# EAGLE design master_control_shield (EAGLE 5.11)
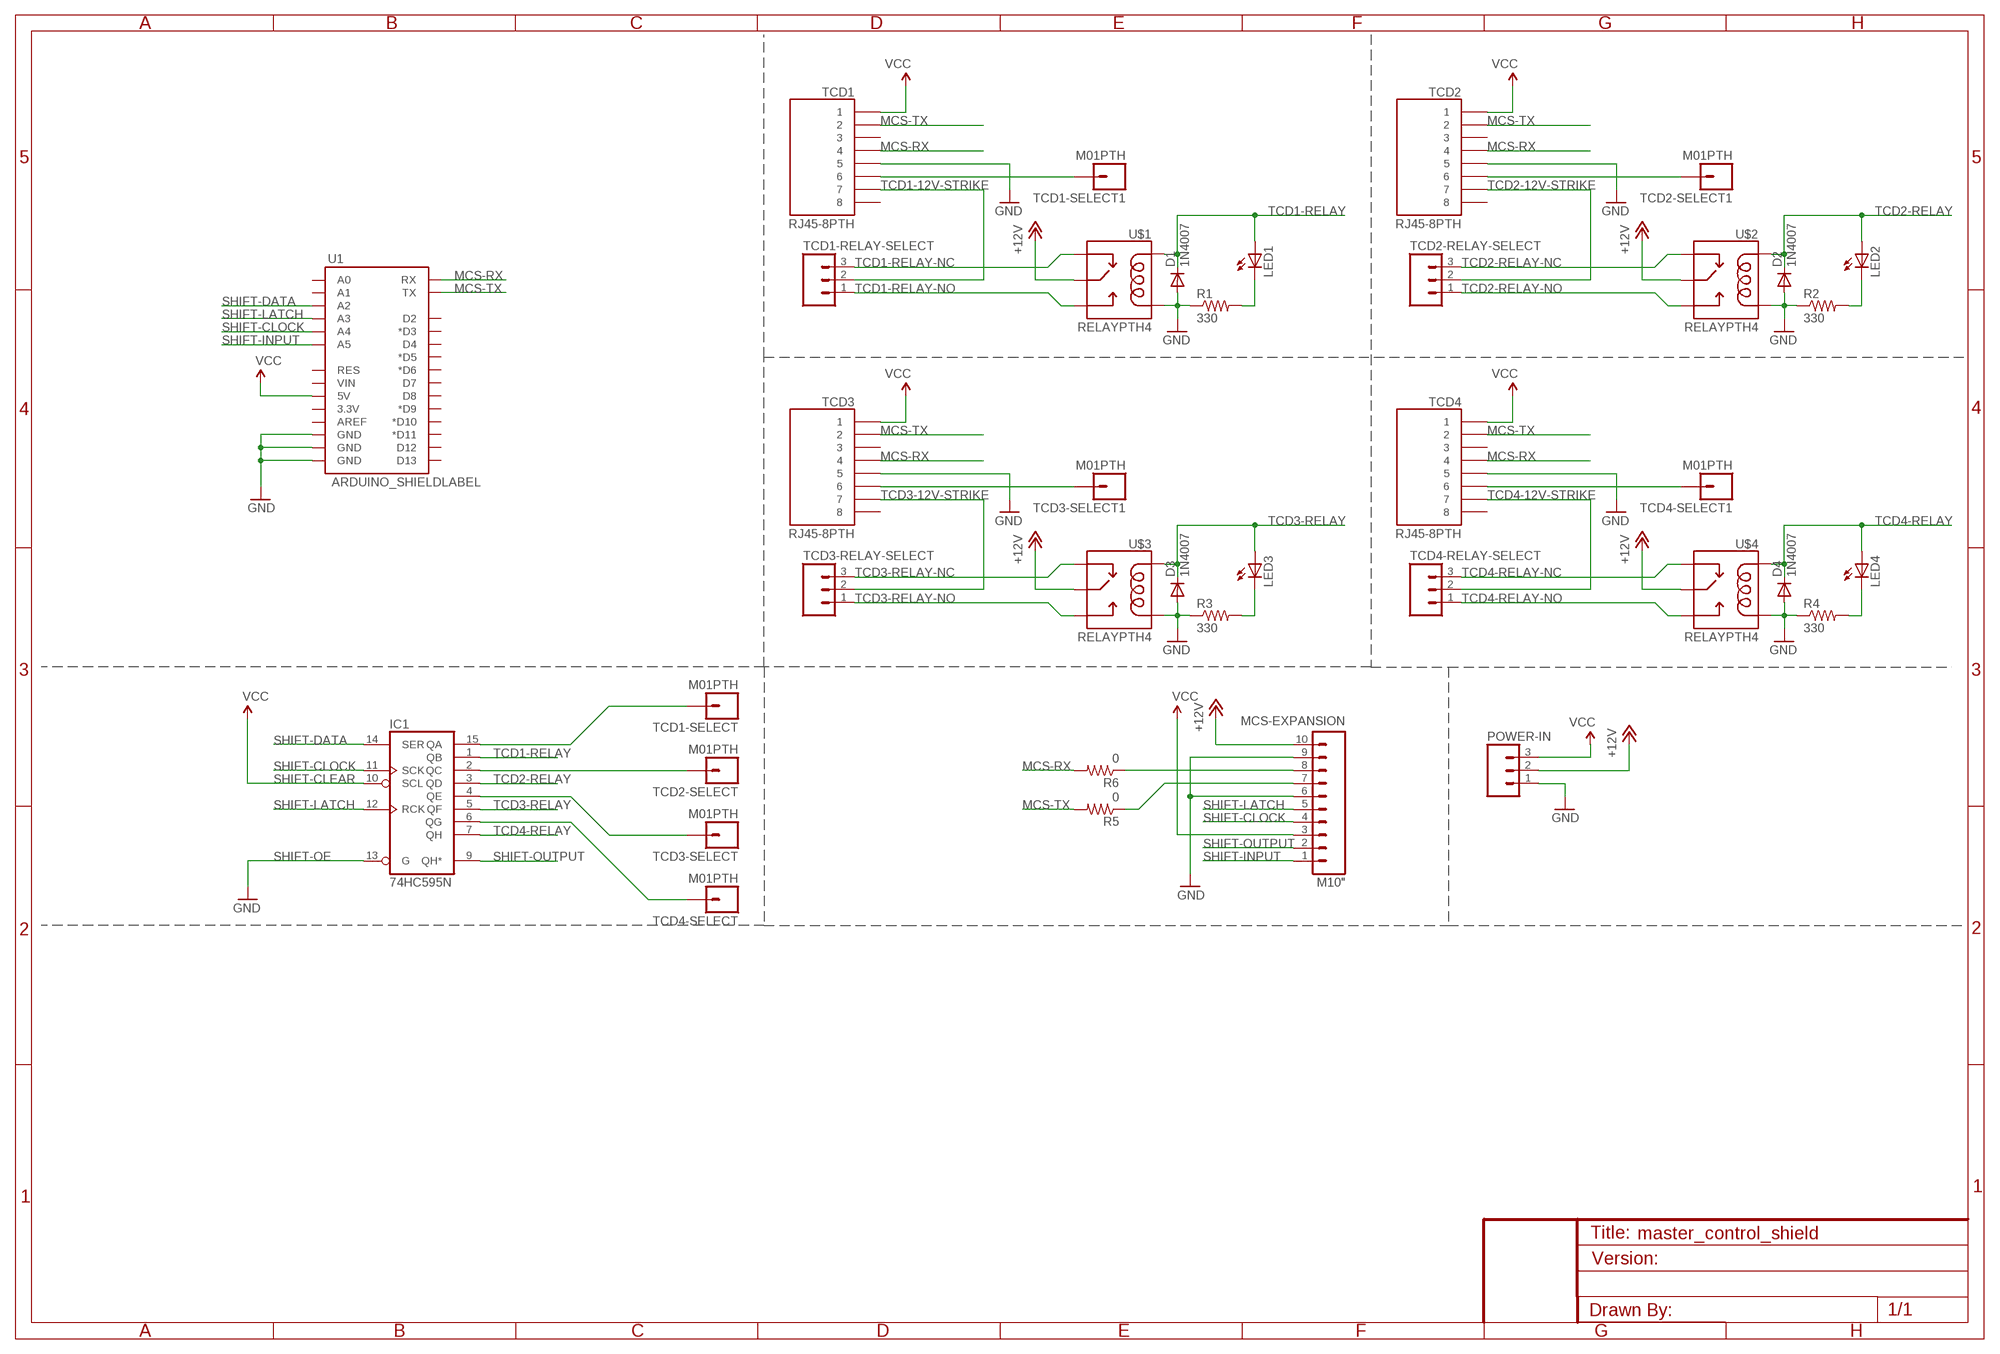
[diagram p0: schematic, sheet 1]

## Parts
D1  1N4007  DIODEPTH  [DIODE-1N4001]
D2  1N4007  DIODEPTH  [DIODE-1N4001]
D3  1N4007  DIODEPTH  [DIODE-1N4001]
D4  1N4007  DIODEPTH  [DIODE-1N4001]
IC1  74HC595N  74LS595N  [DIL16]
LED1  LED5MM  [LED5MM]
LED2  LED5MM  [LED5MM]
LED3  LED5MM  [LED5MM]
LED4  LED5MM  [LED5MM]
MCS-EXPANSION  M10"  [1X10]
POWER-IN  M03SCREW  [SCREWTERMINAL-3.5MM-3]
R1  330  RESISTORPTH-1/4W  [AXIAL-0.4]
R2  330  RESISTORPTH-1/4W  [AXIAL-0.4]
R3  330  RESISTORPTH-1/4W  [AXIAL-0.4]
R4  330  RESISTORPTH-1/4W  [AXIAL-0.4]
R5  0  RESISTORPTH-1/4W  [AXIAL-0.4]
R6  0  RESISTORPTH-1/4W  [AXIAL-0.4]
TCD1  RJ45-8PTH  [RJ45-8]
TCD1-RELAY-SELECT  M03PTH  [1X03]
TCD1-SELECT  M01PTH  [1X01]
TCD1-SELECT1  M01PTH  [1X01]
TCD2  RJ45-8PTH  [RJ45-8]
TCD2-RELAY-SELECT  M03PTH  [1X03]
TCD2-SELECT  M01PTH  [1X01]
TCD2-SELECT1  M01PTH  [1X01]
TCD3  RJ45-8PTH  [RJ45-8]
TCD3-RELAY-SELECT  M03PTH  [1X03]
TCD3-SELECT  M01PTH  [1X01]
TCD3-SELECT1  M01PTH  [1X01]
TCD4  RJ45-8PTH  [RJ45-8]
TCD4-RELAY-SELECT  M03PTH  [1X03]
TCD4-SELECT  M01PTH  [1X01]
TCD4-SELECT1  M01PTH  [1X01]
U1  ARDUINO_SHIELDLABEL  [DUEMILANOVE_SHIELD]
U$1  RELAYPTH4  [RELAY-JZC]
U$2  RELAYPTH4  [RELAY-JZC]
U$3  RELAYPTH4  [RELAY-JZC]
U$4  RELAYPTH4  [RELAY-JZC]

## Nets
+12V [signal]: MCS-EXPANSION.10 POWER-IN.2 U$1.4(MAIN) U$2.4(MAIN) U$3.4(MAIN) U$4.4(MAIN)
GND: D1.A D2.A D3.A D4.A IC1.13(G) MCS-EXPANSION.6 MCS-EXPANSION.9 POWER-IN.1 R1.P$1 R2.P$1 R3.P$1 R4.P$1 TCD1.5 TCD2.5 TCD3.5 TCD4.5 U1.GND@0(GND) U1.GND@1(GND) U1.GND@2(GND) U$1.1(COIL2) U$2.1(COIL2) U$3.1(COIL2) U$4.1(COIL2)
MCS-RX: R6.P$2 TCD1.4 TCD2.4 TCD3.4 TCD4.4 U1.RX
MCS-TX: R5.P$2 TCD1.2 TCD2.2 TCD3.2 TCD4.2 U1.TX
N$1: LED1.K(C) R1.P$2
N$2: LED2.K(C) R2.P$2
N$3: LED3.K(C) R3.P$2
N$4: LED4.K(C) R4.P$2
N$5: MCS-EXPANSION.8 R6.P$1
N$6: MCS-EXPANSION.7 R5.P$1
N$7: IC1.15(QA) TCD1-SELECT.1
N$8: IC1.2(QC) TCD2-SELECT.1
N$9: IC1.4(QE) TCD3-SELECT.1
N$10: IC1.6(QG) TCD4-SELECT.1
N$11: TCD1-SELECT1.1 TCD1.6
N$12: TCD2-SELECT1.1 TCD2.6
N$13: TCD3-SELECT1.1 TCD3.6
N$14: TCD4-SELECT1.1 TCD4.6
SHIFT-CLOCK: IC1.11(SCK) MCS-EXPANSION.4 U1.A4
SHIFT-DATA: IC1.14(SER) U1.A2
SHIFT-INPUT: MCS-EXPANSION.1 U1.A5
SHIFT-LATCH: IC1.12(RCK) MCS-EXPANSION.5 U1.A3
SHIFT-OUTPUT: IC1.9(QH*) MCS-EXPANSION.2
TCD1-12V-STRIKE: TCD1-RELAY-SELECT.2 TCD1.7
TCD1-RELAY: D1.C IC1.1(QB) LED1.A U$1.5(COIL1)
TCD1-RELAY-NC: TCD1-RELAY-SELECT.3 U$1.2(NC)
TCD1-RELAY-NO: TCD1-RELAY-SELECT.1 U$1.3(NO)
TCD2-12V-STRIKE: TCD2-RELAY-SELECT.2 TCD2.7
TCD2-RELAY: D2.C IC1.3(QD) LED2.A U$2.5(COIL1)
TCD2-RELAY-NC: TCD2-RELAY-SELECT.3 U$2.2(NC)
TCD2-RELAY-NO: TCD2-RELAY-SELECT.1 U$2.3(NO)
TCD3-12V-STRIKE: TCD3-RELAY-SELECT.2 TCD3.7
TCD3-RELAY: D3.C IC1.5(QF) LED3.A U$3.5(COIL1)
TCD3-RELAY-NC: TCD3-RELAY-SELECT.3 U$3.2(NC)
TCD3-RELAY-NO: TCD3-RELAY-SELECT.1 U$3.3(NO)
TCD4-12V-STRIKE: TCD4-RELAY-SELECT.2 TCD4.7
TCD4-RELAY: D4.C IC1.7(QH) LED4.A U$4.5(COIL1)
TCD4-RELAY-NC: TCD4-RELAY-SELECT.3 U$4.2(NC)
TCD4-RELAY-NO: TCD4-RELAY-SELECT.1 U$4.3(NO)
VCC: IC1.10(SCL) MCS-EXPANSION.3 POWER-IN.3 TCD1.1 TCD2.1 TCD3.1 TCD4.1 U1.5V
Unconnected: TCD1.3 TCD1.8 TCD2.3 TCD2.8 TCD3.3 TCD3.8 TCD4.3 TCD4.8 U1.3.3V U1.A0 U1.A1 U1.AREF U1.D2 U1.D3(*D3) U1.D4 U1.D5(*D5) U1.D6(*D6) U1.D7 U1.D8 U1.D9(*D9) U1.D10(*D10) U1.D11(*D11) U1.D12 U1.D13 U1.RES U1.VIN

## Notes on the sheet
- SHIFT-CLEAR
- SHIFT-OE

## Power pins joined to a net without a drawn wire
GND: IC1.8(GND)
VCC: IC1.16(VCC)

## Library data of the parts
D1-D4 = SparkFun:DIODE: Diode These are standard reverse protection diodes and small signal diodes. SMA package can handle up to about 1A. SOD-323 can handle about 200mA. What the SOD-323 package when ordering, there are some mfgs out there that are 5-pin packages.
IC1 = 74xx-us:74*595: 8-bit SHIFT REGISTER, output latch
LED1-LED4 = SparkFun:LED: LEDs Standard schematic elements and footprints for 5mm, 3mm, 1206, and 0603 sized LEDs. 5mm - Spark Fun Electronics SKU : COM-00529 (and others)
MCS-EXPANSION = SparkFun:M10: Header 10 Standard 10-pin 0.1" header. Use with straight break away headers (SKU : PRT-00116), right angle break away headers (PRT-00553), swiss pins (PRT-00743), machine pins (PRT-00117), and female headers (PRT-00115).
POWER-IN TCD1-RELAY-SELECT TCD2-RELAY-SELECT TCD3-RELAY-SELECT TCD4-RELAY-SELECT = SparkFun:M03: Header 3 Standard 3-pin 0.1" header. Use with straight break away headers (SKU : PRT-00116), right angle break away headers (PRT-00553), swiss pins (PRT-00743), machine pins (PRT-00117), and female headers (PRT-00115). Molex polarized connector foot print use with SKU : PRT-08232 with associated crimp pins and housings.
R1-R6 = SparkFun:RESISTOR: Resistor Basic schematic elements and footprints for 0603, 1206, and PTH resistors.
TCD1-TCD4 = SparkFun:RJ45-8: RJ45 Jack Simple RJ45, 8-pin connection - connector for common Cat5, Cat5e, and Cat6 Ethernet cables. Footprint not yet proven in production. Connector sku is PRT-00643; Breakout PCB sku is BOB-00716.
TCD1-SELECT TCD1-SELECT1 TCD2-SELECT TCD2-SELECT1 TCD3-SELECT TCD3-SELECT1 TCD4-SELECT TCD4-SELECT1 = SparkFun:M01: Header 1 Standard 1-pin 0.1" header. Use with straight break away headers (SKU : PRT-00116), right angle break away headers (PRT-00553), swiss pins (PRT-00743), machine pins (PRT-00117), and female headers (PRT-00115).
U1 = SparkFun:ARDUINO_SHIELD
U$1-U$4 = SparkFun:RELAY

## Net classes
1 power: width 0.61 mm, clearance 0.406 mm
2 signal: width 0.406 mm, clearance 0.305 mm
3 ground: width 0.406 mm, drill 0.127 mm, clearance 0.254 mm to class 0, clearance 0.254 mm to class 1, clearance 0.254 mm to class 2

## Board
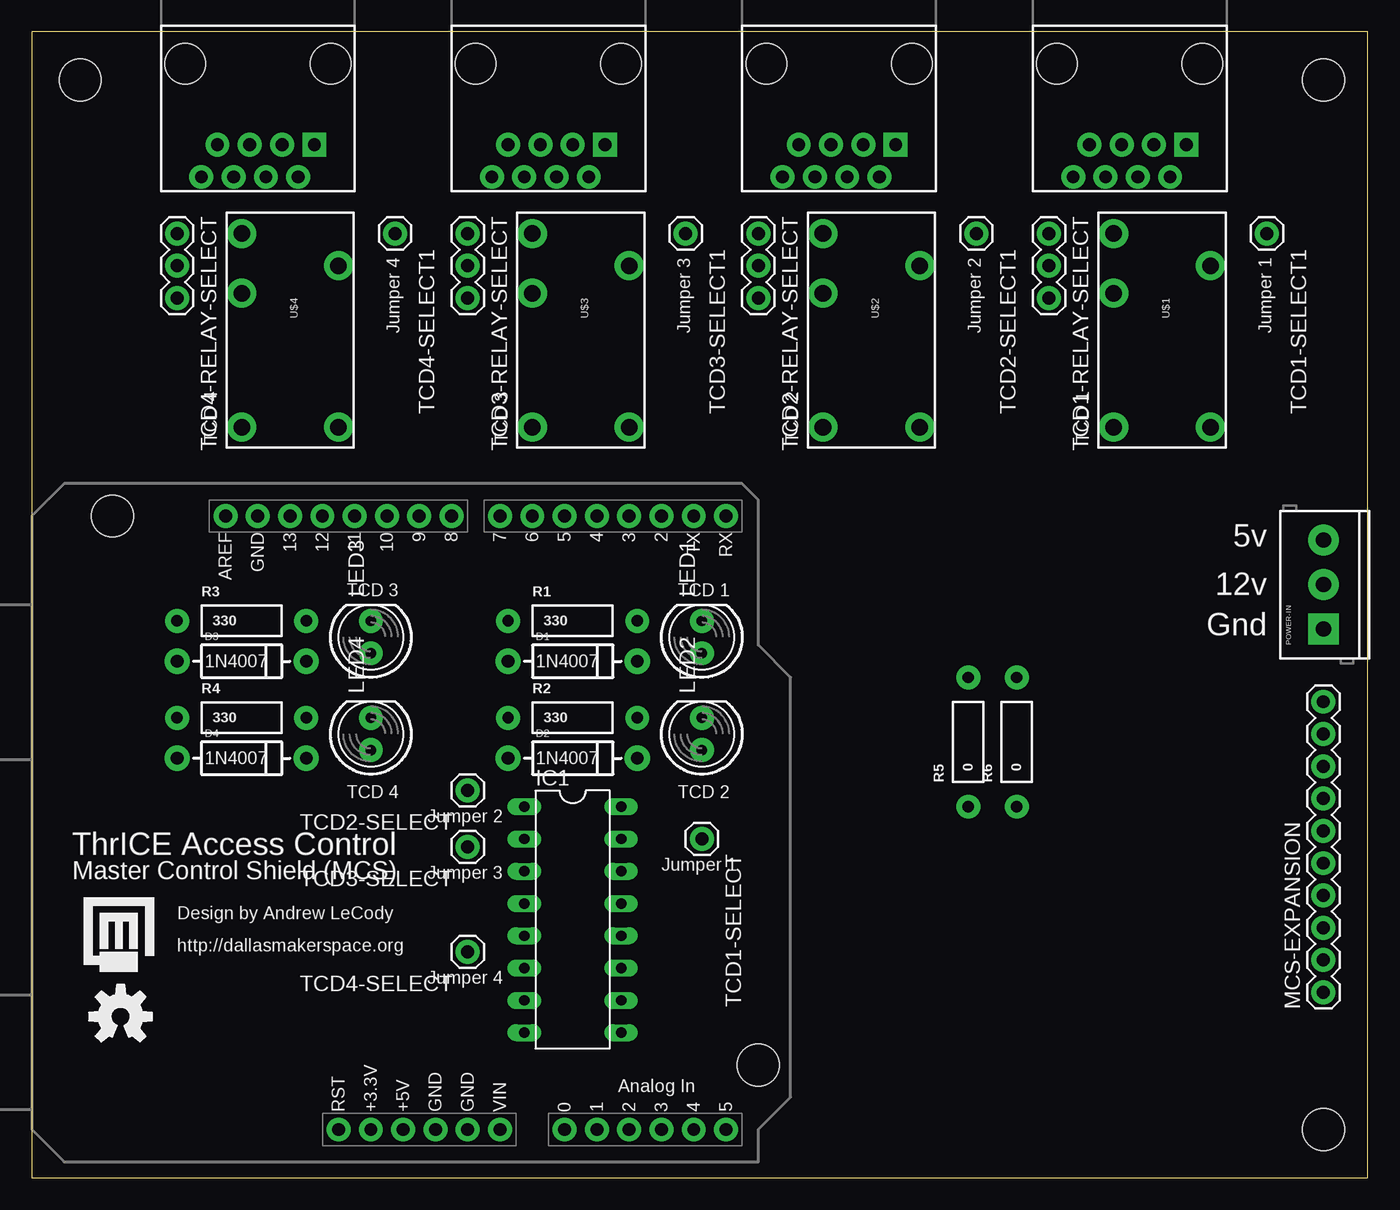
[diagram p1: board, top side]
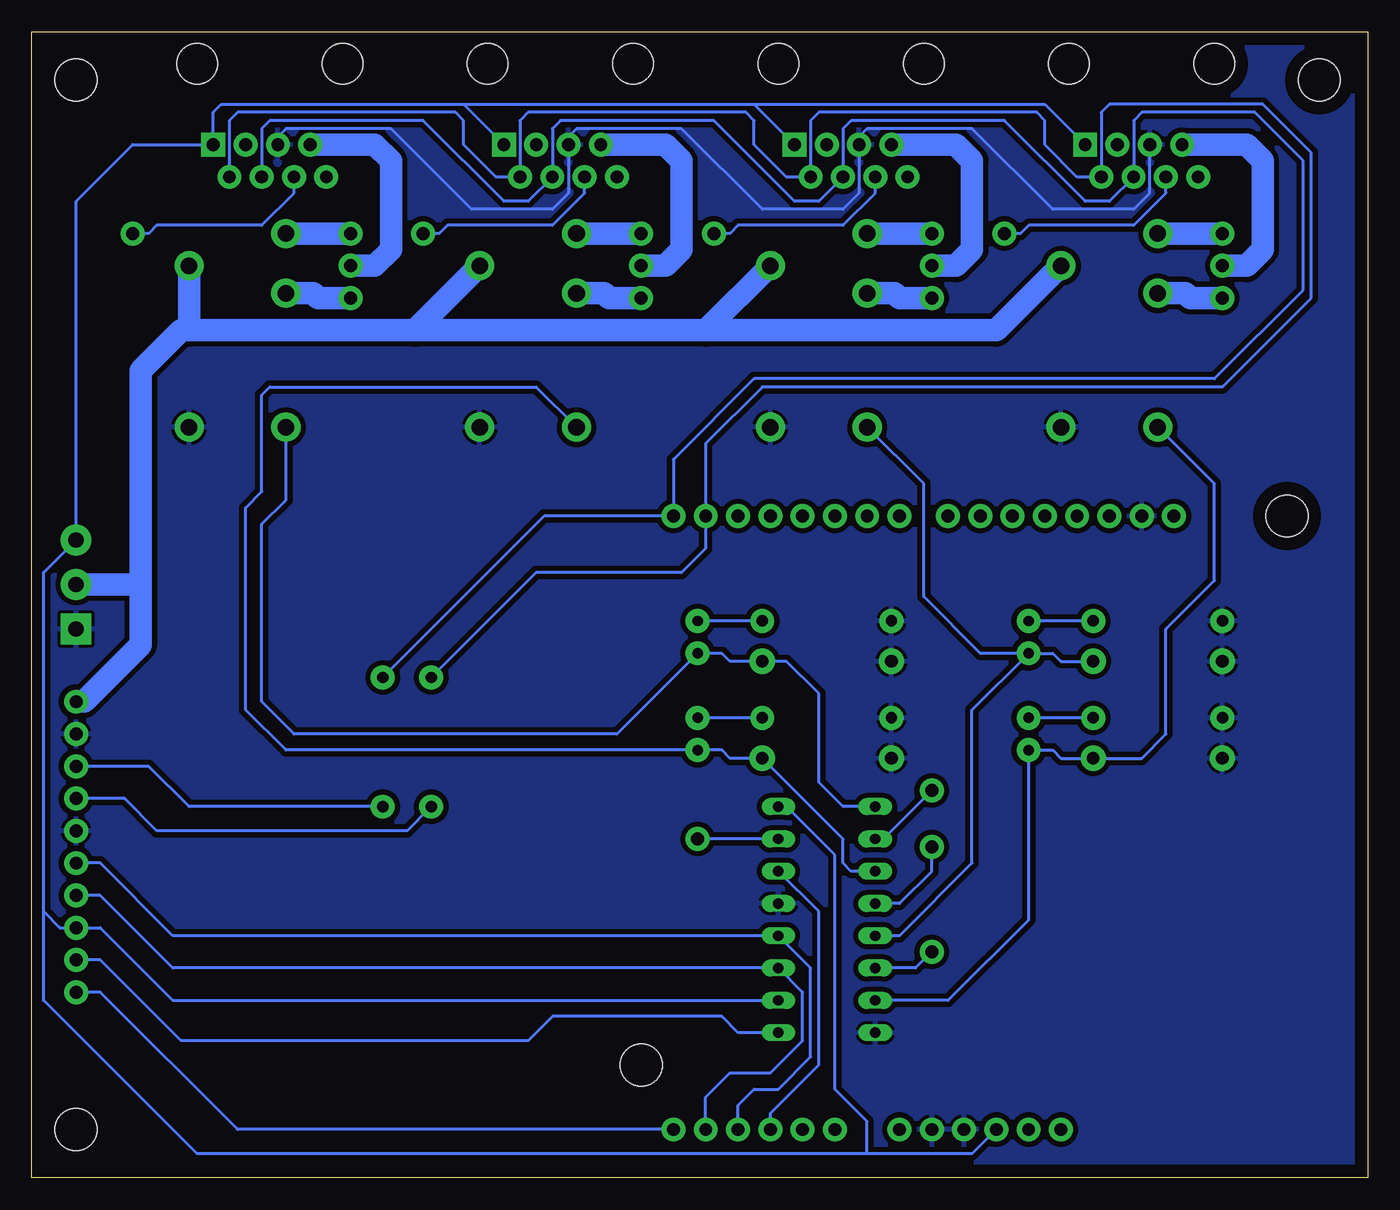
[diagram p2: board, bottom side, seen from below]

Size 105.08 x 90.16 mm. Coordinates in mm from the lower left corner, seen from the top.
Outline: 0,0 105.08,0 105.08,90.16 0,90.16 0,0
Copper layers (1*16): Top 0.035mm / dielectric 1.5mm / Bottom 0.035mm
Design rules "default": minimum track width 10mil, minimum drill 24mil, track to track 8mil, track to pad 8mil, pad to pad 8mil, via to via 8mil, smd to smd 8mil, copper to edge 40mil, drill to drill 8mil, minimum pad ring 10mil, minimum via ring 8mil, stop-mask expansion 4mil, vias tented up to drill 0mil, thermal gap 10mil

### Footprints (pad centres in the part's own frame; a part is rotated, then mirrored left to right if it is on the bottom)
DIODE-1N4001 = drill 1 pad 1.981 round: A -5.08,0; C 5.08,0
DIL16 = drill 0.813 long: 1 -8.89,-3.81; 2 -6.35,-3.81; 3 -3.81,-3.81; 4 -1.27,-3.81; 5 1.27,-3.81; 6 3.81,-3.81; 7 6.35,-3.81; 8 8.89,-3.81; 9 8.89,3.81; 10 6.35,3.81; 11 3.81,3.81; 12 1.27,3.81; 13 -1.27,3.81; 14 -3.81,3.81; 15 -6.35,3.81; 16 -8.89,3.81
LED5MM = drill 0.813 pad 1.88 round: A -1.27,0; K 1.27,0
1X10 = drill 1.016 pad 1.88 round: 1 0,0; 2 2.54,0; 3 5.08,0; 4 7.62,0; 5 10.16,0; 6 12.7,0; 7 15.24,0; 8 17.78,0; 9 20.32,0; 10 22.86,0
SCREWTERMINAL-3.5MM-3 = drill 1.2 pad 2.413 square: 1 0,0 | drill 1.2 pad 2.413 round: 2 3.5,0; 3 7,0
AXIAL-0.4 = drill 0.9 pad 1.88 round: P$1 -5.08,0; P$2 5.08,0
RJ45-8 = drill 1 pad 1.88 square: 1 -4.445,6.35 | drill 1 pad 1.88 round: 2 -3.175,8.89; 3 -1.905,6.35; 4 -0.635,8.89; 5 0.635,6.35; 6 1.905,8.89; 7 3.175,6.35; 8 4.445,8.89 | hole 3.2: -5.715,0; 5.715,0
1X03 = drill 1.016 pad 1.88 round: 1 0,0; 2 2.54,0; 3 5.08,0
1X01 = drill 1.016 pad 1.88 round: 1 0,0
DUEMILANOVE_SHIELD = drill 1.016 pad 1.88 round: 3.3V 50.8,26.67; 5V 50.8,29.21; A0 50.8,41.91; A1 50.8,44.45; A2 50.8,46.99; A3 50.8,49.53; A4 50.8,52.07; A5 50.8,54.61; AREF 2.54,15.24; D2 2.54,49.53; D3 2.54,46.99; D4 2.54,44.45; D5 2.54,41.91; D6 2.54,39.37; D7 2.54,36.83; D8 2.54,33.02; D9 2.54,30.48; D10 2.54,27.94; D11 2.54,25.4; D12 2.54,22.86; D13 2.54,20.32; GND@0 50.8,31.75; GND@1 50.8,34.29; GND@2 2.54,17.78; RES 50.8,24.13; RX 2.54,54.61; TX 2.54,52.07; VIN 50.8,36.83 | hole 3.302: 45.72,57.15; 2.54,6.35
RELAY-JZC = drill 1.3 pad 2.286 round: 1 3.81,-8.89; 2 -3.81,1.651; 3 -3.81,6.35; 4 3.81,3.81; 5 -3.81,-8.89
STAND-OFF = hole 3.302: 0,0

### Placement (x,y rotation side)
D1  42.55,40.64 0 top
D2  42.55,33.02 0 top
D3  16.51,40.64 0 top
D4  16.51,33.02 0 top
IC1  42.55,20.32 270 top
LED1  52.7,42.55 90 top
LED2  52.7,34.92 90 top
LED3  26.67,42.55 90 top
LED4  26.67,34.92 90 top
MCS-EXPANSION  101.6,14.61 90 top
POWER-IN  101.6,43.18 90 top
R1  42.55,43.81 0 top
R2  42.55,36.2 0 top
R3  16.51,43.81 0 top
R4  16.51,36.2 0 top
R5  73.66,34.29 90 top
R6  77.47,34.29 90 top
TCD1  86.36,87.63 180 top
TCD1-RELAY-SELECT  80.01,74.3 270 top
TCD1-SELECT  52.7,26.67 270 top
TCD1-SELECT1  97.16,74.3 270 top
TCD2  63.5,87.63 180 top
TCD2-RELAY-SELECT  57.15,74.3 270 top
TCD2-SELECT  34.29,30.48 180 top
TCD2-SELECT1  74.3,74.3 270 top
TCD3  40.64,87.63 180 top
TCD3-RELAY-SELECT  34.29,74.3 270 top
TCD3-SELECT  34.29,26.04 180 top
TCD3-SELECT1  51.44,74.3 270 top
TCD4  17.78,87.63 180 top
TCD4-RELAY-SELECT  11.43,74.3 270 top
TCD4-SELECT  34.29,17.78 180 top
TCD4-SELECT1  28.57,74.3 270 top
U1  0,54.61 270 top
U$1  88.9,67.94 0 top
U$2  66.04,67.94 0 top
U$3  43.18,67.94 0 top
U$4  20.32,67.94 0 top
U$5  [STAND-OFF]  3.81,86.36 0 top
U$6  [STAND-OFF]  101.6,86.36 0 top
U$7  [STAND-OFF]  101.6,3.81 0 top
U$8  [STAND-OFF]  6.35,52.07 0 top
U$9  [STAND-OFF]  57.15,8.89 0 top
U$10  [DMS-LOGO]  3.81,15.88 0 top
U$11  [OSHW-LOGO-M]  6.99,12.7 0 top

### Tracks (layer width: path | path; a pad name or v marks a point on that pad's centre or on a via)
+12V
  Bottom 1.778: 74.93,66.67 92.71,66.67 | 74.93,66.67 U$2.4 | 92.71,66.67 U$1.4 | 52.07,66.67 U$3.4 | 52.07,66.67 74.93,66.67 | U$4.4 29.21,66.67 52.07,66.67 | 92.71,66.67 93.34,66.67 96.52,63.5 96.52,46.99 | MCS-EXPANSION.10 100.97,37.47 96.52,41.91 96.52,46.99 | POWER-IN.2 96.83,46.68 96.52,46.99
GND
  Bottom 0.254: TCD4.5 17.14,77.47 18.41,76.2 24.77,76.2 31.11,82.55 39.37,82.55 40.01,81.92 TCD3.5 40.01,77.47 41.27,76.2 47.62,76.2 53.98,82.55 62.23,82.55 62.87,81.92 TCD2.5 62.87,77.47 64.14,76.2 70.48,76.2 76.83,82.55 85.09,82.55 85.72,81.92 TCD1.5
  pour Bottom (isolate 0.406): 0,90.17 105.41,90.17 105.41,0 0,0
MCS-RX
  Bottom 0.254: TCD1.4 87,82.55 86.36,83.19 74.3,83.19 67.94,76.83 66.04,76.83 TCD2.4 64.14,82.55 63.5,83.19 51.44,83.19 45.09,76.83 43.18,76.83 TCD3.4 41.27,82.55 40.64,83.19 28.57,83.19 22.23,76.83 20.32,76.83 TCD4.4 18.41,83.19 17.78,83.82 8.89,83.82 5.08,80.01 5.08,69.85 12.06,62.87 48.26,62.87 54.61,56.52 U1.RX 64.77,52.07 R6.P$2
MCS-TX
  Bottom 0.254: TCD1.2 89.53,83.19 88.9,83.82 71.75,83.82 71.12,83.19 71.12,81.28 68.58,78.74 TCD2.2 66.67,83.19 66.04,83.82 48.9,83.82 48.26,83.19 48.26,81.28 45.72,78.74 TCD3.2 43.81,83.19 43.18,83.82 26.04,83.82 25.4,83.19 25.4,81.28 22.86,78.74 TCD4.2 20.95,83.82 20.32,84.45 8.26,84.45 4.45,80.64 4.45,69.22 11.43,62.23 47.62,62.23 52.07,57.78 U1.TX 52.07,49.53 53.98,47.62 65.41,47.62 R5.P$2
N$1
  Bottom 0.254: R1.P$2 LED1.K
N$2
  Bottom 0.254: R2.P$2 LED2.K
N$3
  Bottom 0.254: R3.P$2 LED3.K
N$4
  Bottom 0.254: R4.P$2 LED4.K
N$5
  Bottom 0.254: MCS-EXPANSION.8 95.89,32.38 92.71,29.21 R6.P$1
N$6
  Bottom 0.254: MCS-EXPANSION.7 97.79,29.84 95.25,27.3 75.56,27.3 R5.P$1
N$7
  Bottom 0.254: IC1.15 TCD1-SELECT.1
N$8
  Bottom 0.254: IC1.2 38.1,26.67 TCD2-SELECT.1
N$9
  Bottom 0.254: IC1.4 36.83,21.59 34.29,24.13 TCD3-SELECT.1
N$10
  Bottom 0.254: IC1.6 35.56,16.51 TCD4-SELECT.1
N$11
  Bottom 0.254: TCD1.6 84.45,77.47 87,74.93 95.25,74.93 95.89,74.3 TCD1-SELECT1.1
N$12
  Bottom 0.254: TCD2.6 61.59,77.47 64.14,74.93 72.39,74.93 73.03,74.3 TCD2-SELECT1.1
N$13
  Bottom 0.254: TCD3.6 38.73,77.47 41.27,74.93 49.53,74.93 50.16,74.3 TCD3-SELECT1.1
N$14
  Bottom 0.254: TCD4.6 15.88,77.47 18.41,74.93 26.67,74.93 27.3,74.3 TCD4-SELECT1.1
SHIFT-CLOCK
  Bottom 0.254: MCS-EXPANSION.4 99.69,22.23 93.98,16.51 IC1.11 44.45,14.61 44.45,10.79 46.99,8.26 50.16,8.26 52.07,6.35 U1.A4
SHIFT-DATA
  Bottom 0.254: U1.A2 46.99,5.08 43.18,8.89 43.18,20.95 IC1.14
SHIFT-INPUT
  Bottom 0.254: MCS-EXPANSION.1 99.69,14.61 88.9,3.81 U1.A5
SHIFT-LATCH
  Bottom 0.254: MCS-EXPANSION.5 99.69,24.77 93.98,19.05 IC1.12 43.81,16.51 43.81,9.53 46.35,6.99 48.26,6.99 49.53,5.71 U1.A3
SHIFT-OUTPUT
  Bottom 0.254: MCS-EXPANSION.2 99.69,17.14 93.34,10.79 66.04,10.79 64.14,12.7 50.8,12.7 49.53,11.43 IC1.9
TCD1-12V-STRIKE
  Bottom 1.778: TCD1-RELAY-SELECT.2 78.11,71.75 76.83,73.03 76.83,80.01 78.11,81.28 TCD1.7
TCD1-RELAY
  Bottom 0.254: IC1.1 41.27,29.21 43.18,31.11 43.18,38.1 45.72,40.64 D1.C 50.16,40.64 50.8,41.27 LED1.A 59.05,34.92 84.45,34.92 87,37.47 87,51.44 85.09,53.34 U$1.5
TCD1-RELAY-NC
  Bottom 1.778: U$1.2 82.93,69.6 82.55,69.22 TCD1-RELAY-SELECT.3
TCD1-RELAY-NO
  Bottom 1.778: TCD1-RELAY-SELECT.1 U$1.3
TCD2-12V-STRIKE
  Bottom 1.778: TCD2-RELAY-SELECT.2 55.24,71.75 53.98,73.03 53.98,80.01 55.24,81.28 TCD2.7
TCD2-RELAY
  Bottom 0.254: IC1.3 40.64,24.13 41.27,24.77 41.27,26.67 D2.C 50.16,33.02 50.8,33.66 LED2.A 85.09,33.66 88.27,36.83 88.27,52.7 87,53.98 87,61.59 86.36,62.23 65.41,62.23 U$2.5
TCD2-RELAY-NC
  Bottom 1.778: U$2.2 60.07,69.6 59.69,69.22 TCD2-RELAY-SELECT.3
TCD2-RELAY-NO
  Bottom 1.778: TCD2-RELAY-SELECT.1 U$2.3
TCD3-12V-STRIKE
  Bottom 1.778: TCD3-RELAY-SELECT.2 32.38,71.75 31.11,73.03 31.11,80.01 32.38,81.28 TCD3.7
TCD3-RELAY
  Bottom 0.254: LED3.A 24.77,41.27 24.13,40.64 D3.C | IC1.5 36.83,19.05 31.11,24.77 31.11,36.83 LED3.A | LED3.A 30.48,41.27 34.92,45.72 34.92,54.61 U$3.5
TCD3-RELAY-NC
  Bottom 1.778: U$3.2 37.21,69.6 36.83,69.22 TCD3-RELAY-SELECT.3
TCD3-RELAY-NO
  Bottom 1.778: TCD3-RELAY-SELECT.1 U$3.3
TCD4-12V-STRIKE
  Bottom 1.778: TCD4-RELAY-SELECT.2 9.53,71.75 8.26,73.03 8.26,80.01 9.53,81.28 TCD4.7
TCD4-RELAY
  Bottom 0.254: IC1.7 33.02,13.97 26.67,20.32 LED4.A 24.77,33.66 24.13,33.02 D4.C 17.78,33.02 15.88,34.92 15.88,43.18 12.06,46.99 12.06,54.61 U$4.5
TCD4-RELAY-NC
  Bottom 1.778: U$4.2 14.35,69.6 13.97,69.22 TCD4-RELAY-SELECT.3
TCD4-RELAY-NO
  Bottom 1.778: TCD4-RELAY-SELECT.1 U$4.3
VCC
  Bottom 0.254: U1.5V 31.11,1.91 39.37,1.91 | 39.37,1.91 92.08,1.91 104.14,13.97 104.14,20.95 | IC1.10 93.98,13.97 99.69,19.68 MCS-EXPANSION.3 102.87,19.68 104.14,20.95 | 71.12,84.45 48.26,84.45 | 48.26,84.45 25.4,84.45 TCD4.1 | 48.26,84.45 TCD3.1 | 71.12,84.45 TCD2.1 | 71.12,84.45 90.17,84.45 90.81,83.82 TCD1.1 97.16,81.28 101.6,76.83 POWER-IN.3 104.14,47.64 104.14,20.95 | IC1.16 45.72,29.21 41.91,25.4 41.91,6.99 39.37,4.45 39.37,1.91

### Text on the board
tPlace: Jumper 4 | Jumper 3 | Jumper 2 | Jumper 1 | TCD 4 | TCD 3 | TCD 2 | TCD 1 | 5v | 12v | TCD 3 | TCD 1 | Gnd | TCD 4 | TCD 2 | Jumper 2 | ThrICE Access Control | Jumper 1 | Master Control Shield (MCS) | Jumper 3 | Design by Andrew LeCody | http://dallasmakerspace.org | Jumper 4
200bmp: /home/aceat64/Downloads/DMS_Logo_Black.bmp